# EAGLE design PDB_Board (EAGLE 9.6.2)
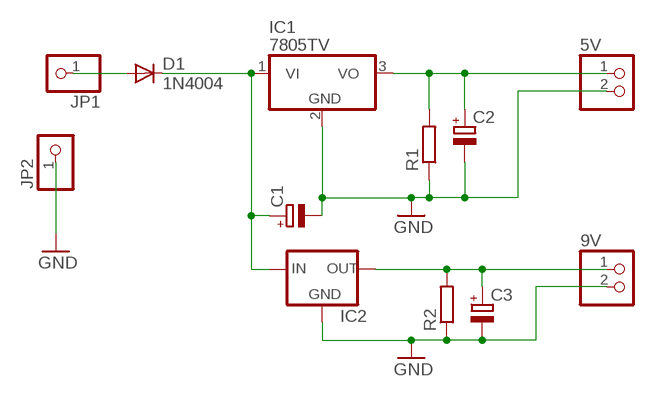
[diagram p0: schematic, sheet 1]

## Parts
5V  PINHD-1X2/OCT  [1X02/OCT]
9V  PINHD-1X2/OCT  [1X02/OCT]
C1  CPOL-EUE3.5-8  [E3,5-8]
C2  CPOL-EUE2.5-5  [E2,5-5]
C3  CPOL-EUE2.5-5  [E2,5-5]
D1  1N4004  [DO41-10]
IC1  7805TV  [TO220V]
IC2  78XXS  [78XXS]
JP1  PINHD-1X1  [1X01]
JP2  PINHD-1X1  [1X01]
R1  R-EU_0207/10  [0207/10]
R2  R-EU_0207/10  [0207/10]

## Nets
GND: 5V.2 9V.2 C1.- C2.- C3.- IC1.2(GND) IC2.GND JP2.1 R1.1 R2.1
N$1: C1.+ D1.C IC1.1(VI) IC2.IN
N$2: 9V.1 C3.+ IC2.OUT R2.2
N$3: 5V.1 C2.+ IC1.3(VO) R1.2
N$4: D1.A JP1.1

## Library data of the parts
5V 9V = pinhead_v2:PINHD-1X2: PIN HEADER
C1-C3 = rcl:CPOL-EU: POLARIZED CAPACITOR, European symbol; SPICEPREFIX: C
D1 = adafruit:1N4004: DIODE General purpose 1N400x type rectifier (With bigger pads) http://www.ladyada.net/library/pcb/eaglelibrary.html
IC1 = linear:78*: Positive VOLTAGE REGULATOR Source: http://cache.national.com/ds/LM/LM78L05.pdf http://www.fairchildsemi.com/ds/LM/LM7805.pdf
IC2 = v-reg:78XXS: VOLTAGE REGULATOR
JP1 JP2 = pinhead:PINHD-1X1: PIN HEADER
R1 R2 = rcl:R-EU_: RESISTOR, European symbol; SPICEPREFIX: R

## Board
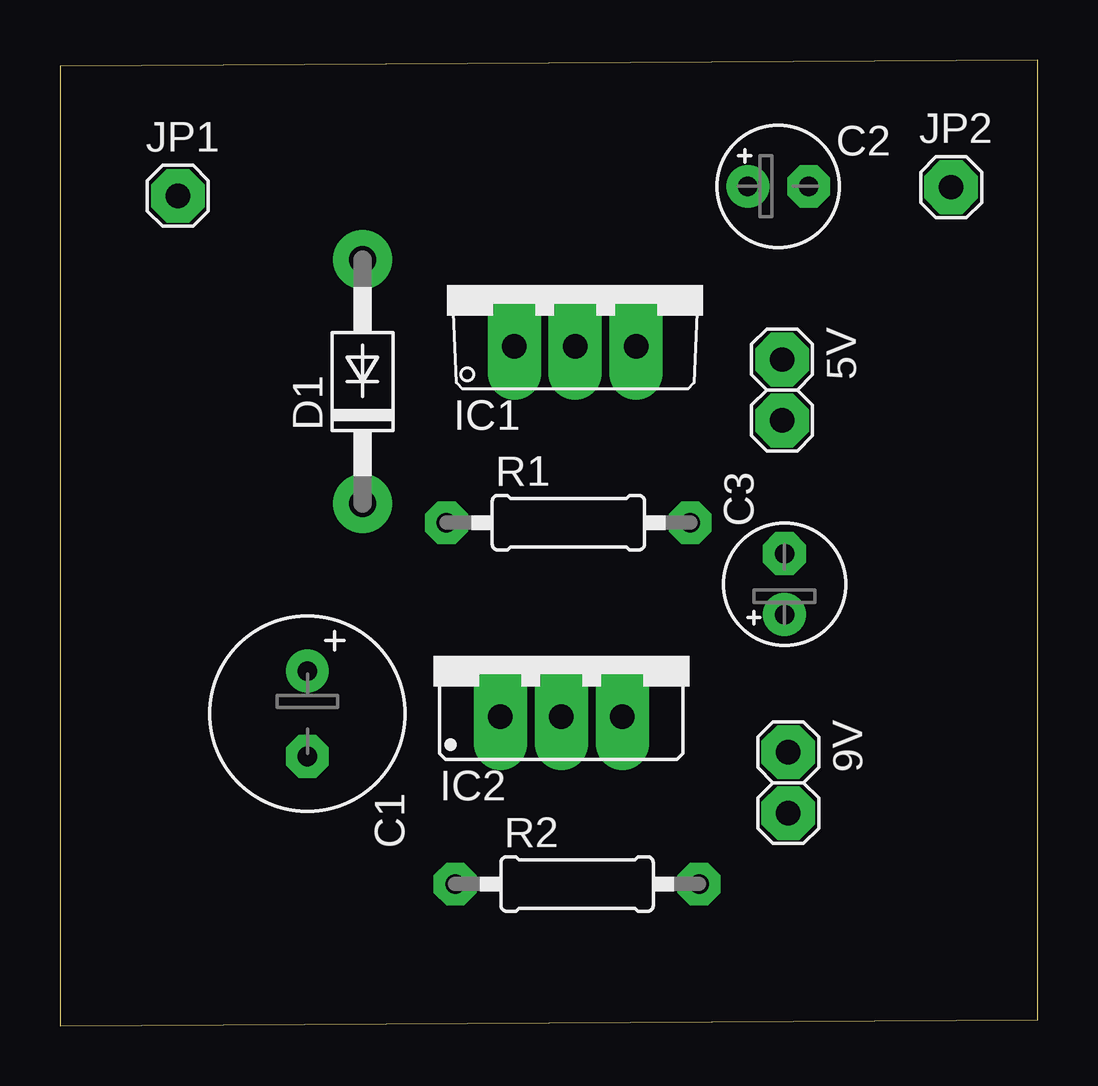
[diagram p1: board, top side]
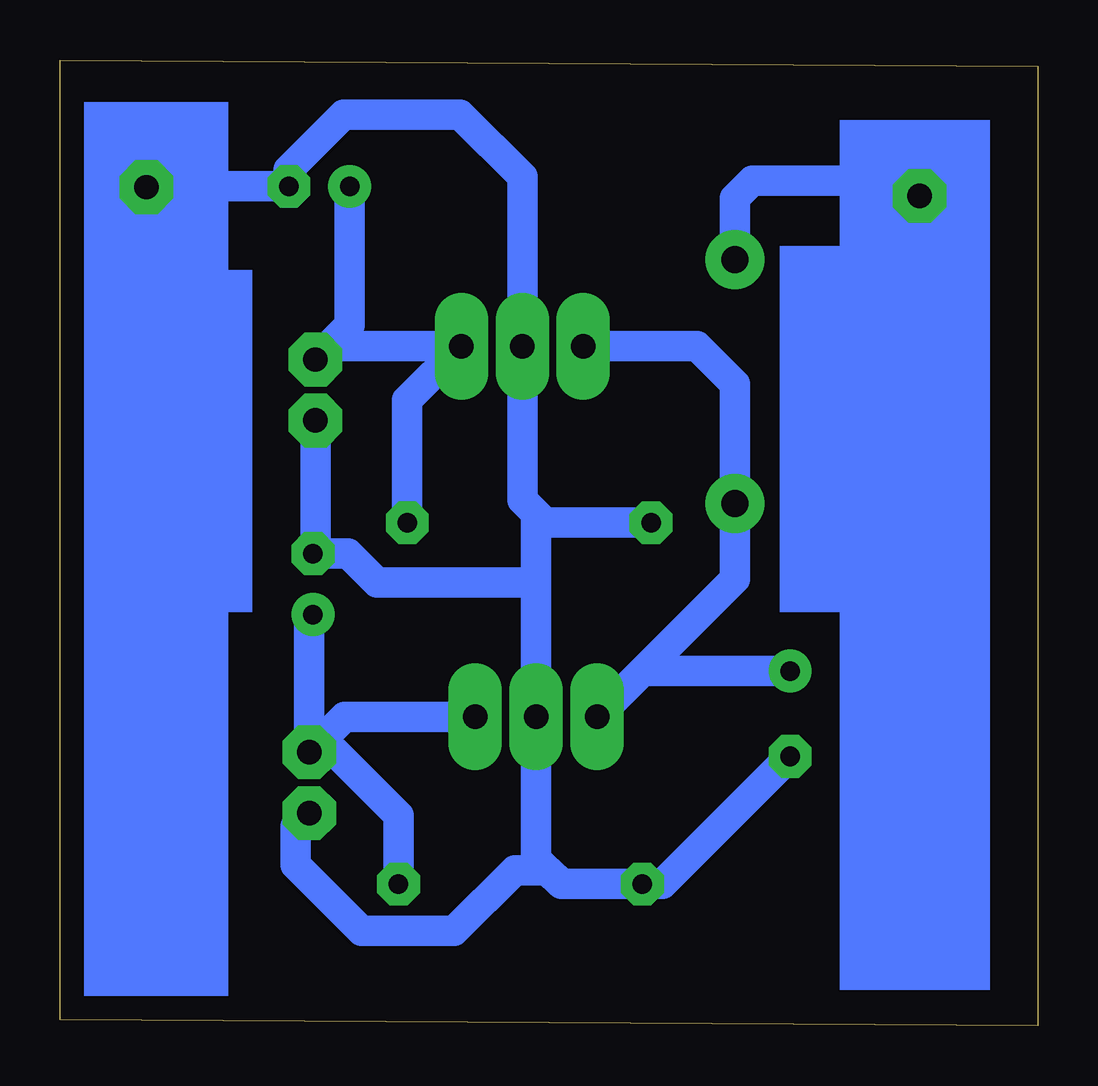
[diagram p2: board, bottom side, seen from below]

Size 40.75 x 40.25 mm. Coordinates in mm from the lower left corner, seen from the top.
Outline: 0,0 40.75,0.25 40.75,40.25 0,40 0,0
Copper layers (1*16): Top 0.035mm / dielectric 0.15mm / Bottom 0.035mm
Design rules "default *": minimum track width 6mil, minimum drill 0.35mm, track to track 6mil, track to pad 6mil, pad to pad 6mil, via to via 6mil, smd to smd 6mil, copper to edge 40mil, drill to drill 6mil, minimum pad ring 10mil, minimum via ring 8mil, stop-mask expansion 4mil, vias tented up to drill 0mil, thermal gap 10mil

### Footprints (pad centres in the part's own frame; a part is rotated, then mirrored left to right if it is on the bottom)
1X02/OCT = drill 1.016 octagon: 1 -1.27,0; 2 1.27,0
E3,5-8 = drill 0.813 pad 1.6: + -1.778,0 | drill 0.813 pad 1.6 octagon: - 1.778,0
E2,5-5 = drill 0.813 pad 1.6: + -1.27,0 | drill 0.813 pad 1.6 octagon: - 1.27,0
DO41-10 = drill 1.118 pad 1.93: A 5.08,0; C -5.08,0
TO220V = drill 1.016 long: 1 -2.54,-2.54; 2 0,-2.54; 3 2.54,-2.54
78XXS = drill 1.016 long: GND 0,-2.54; IN -2.54,-2.54; OUT 2.54,-2.54
1X01 = drill 1.016 octagon: 1 0,0
0207/10 = drill 0.813 octagon: 1 -5.08,0; 2 5.08,0

### Placement (x,y rotation side)
5V  30.1,26.49 270 top
9V  30.36,10.12 270 top
C1  10.31,13 270 top
C2  29.94,34.98 0 top
C3  30.2,18.4 90 top
D1  12.61,26.84 90 top
IC1  21.48,30.86 0 top
IC2  20.9,15.41 0 top
JP1  4.91,34.58 0 top
JP2  37.15,34.95 0 top
R1  21.19,20.96 0 top
R2  21.56,5.9 0 top

### Tracks (layer width: path | path; a pad name or v marks a point on that pad's centre or on a via)
GND
  Bottom 1.27: R1.1 20.52,20.96 20.9,21.33 | 20.9,18.46 IC2.GND 20.9,6.95 20.43,6.48 | 20.9,18.46 20.9,21.33 | 20.9,21.33 21.48,21.91 IC1.2 21.48,35.38 24.07,37.97 28.92,37.97 31.21,35.68 C2.- 37.12,34.98 JP2.1 | 20.43,6.48 19.85,5.9 R2.1 15.63,5.9 C1.- | 20.43,6.48 21.79,6.48 24.32,3.95 28.17,3.95 30.92,6.7 30.92,8.3 9V.2 | 20.9,18.46 27.52,18.46 28.73,19.67 C3.- 30.1,19.77 5V.2
N$1
  Bottom 1.27: IC1.1 14.19,28.32 12.61,26.74 D1.C 12.61,18.62 IC2.IN 16.46,14.78 C1.+
N$2
  Bottom 1.27: IC2.OUT 28.88,12.87 9V.1 | R2.2 26.64,8.77 29.27,11.39 9V.1 | 9V.1 30.36,16.97 C3.+
N$3
  Bottom 1.27: R1.2 26.27,26.07 IC1.3 29.54,28.32 5V.1 28.67,29.19 C2.+
N$4
  Bottom 1.27: JP1.1 5.55,35.23 11.88,35.23 12.61,34.49 D1.A
(copper drawn outside any net)
  shapes: Bottom area x4